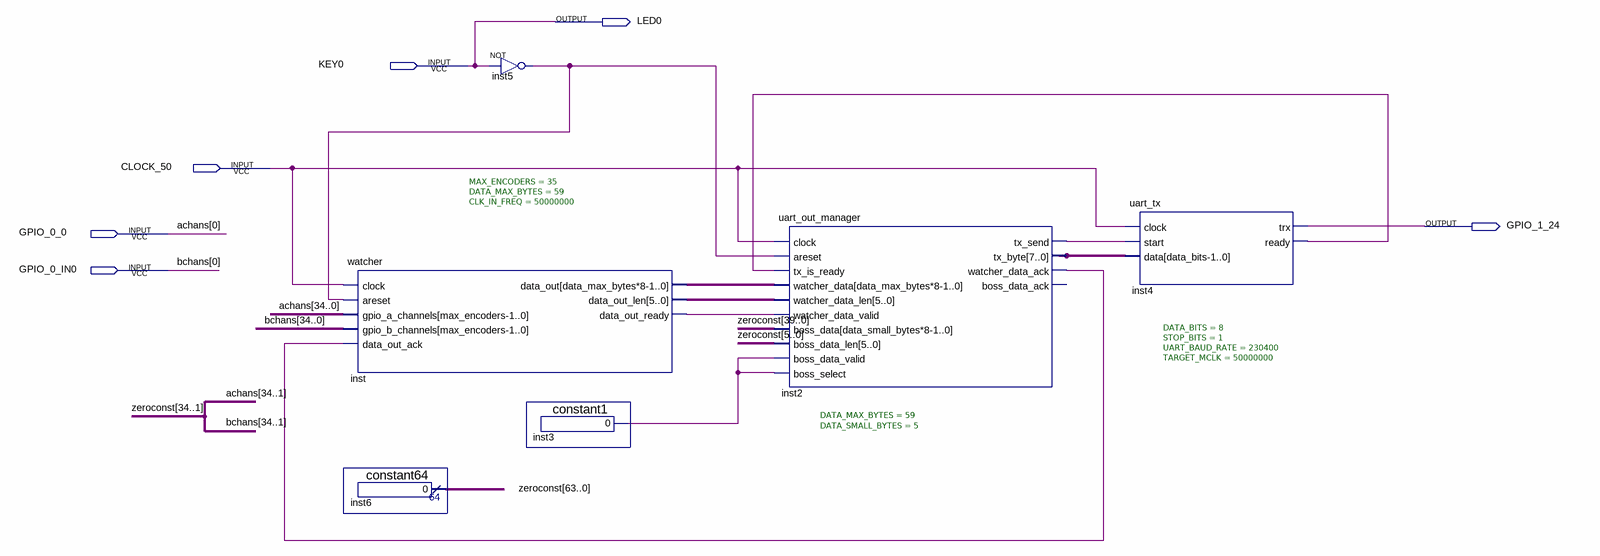
[diagram p0: schematic sheet]
// Quartus schematic FK_quadrature_decoder.bdf as structural Verilog: 6 symbols, 6 pins
module FK_quadrature_decoder (
  input  KEY0,
  input  CLOCK_50,
  input  GPIO_0_0,
  input  GPIO_0_IN0,
  output LED0,
  output GPIO_1_24
);

  wire inst2_tx_send, inst2_watcher_data_ack, inst3_result, inst4_ready, inst5_out, inst_data_out_ready;
  wire [5:0] inst_data_out_len;
  wire [7:0] inst2_tx_byte;
  wire [34:1] achans, bchans;
  wire [63:0] zeroconst;
  wire [471:0] inst_data_out;

  watcher #(.MAX_ENCODERS(35), .DATA_MAX_BYTES(59), .CLK_IN_FREQ(50000000)) inst (
    .clock(CLOCK_50), .areset(inst5_out), .gpio_a_channels({achans, GPIO_0_0}),
    .gpio_b_channels({bchans, GPIO_0_IN0}), .data_out_ack(inst2_watcher_data_ack), .data_out(inst_data_out),
    .data_out_len(inst_data_out_len), .data_out_ready(inst_data_out_ready));
  constant64 inst6 (.result(zeroconst));
  not inst5 (inst5_out, KEY0);
  constant1 inst3 (.result(inst3_result));
  uart_out_manager #(.DATA_MAX_BYTES(59), .DATA_SMALL_BYTES(5)) inst2 (
    .clock(CLOCK_50), .areset(inst5_out), .tx_is_ready(inst4_ready), .watcher_data(inst_data_out),
    .watcher_data_len(inst_data_out_len), .watcher_data_valid(inst_data_out_ready),
    .boss_data(zeroconst[39:0]), .boss_data_len(zeroconst[5:0]), .boss_data_valid(inst3_result),
    .boss_select(inst3_result), .tx_send(inst2_tx_send), .tx_byte(inst2_tx_byte),
    .watcher_data_ack(inst2_watcher_data_ack));  // open: boss_data_ack
  uart_tx #(.DATA_BITS(8), .STOP_BITS(1), .UART_BAUD_RATE(230400), .TARGET_MCLK(50000000)) inst4 (
    .clock(CLOCK_50), .start(inst2_tx_send), .data(inst2_tx_byte), .trx(GPIO_1_24), .ready(inst4_ready));

  assign LED0 = KEY0;

  // Other names for the same wires on the sheet: achans[0] = GPIO_0_0; bchans[0] = GPIO_0_IN0
endmodule
